# EAGLE design SparkFun_USB_MicroB_Plug_Breakout (EAGLE 6.4)
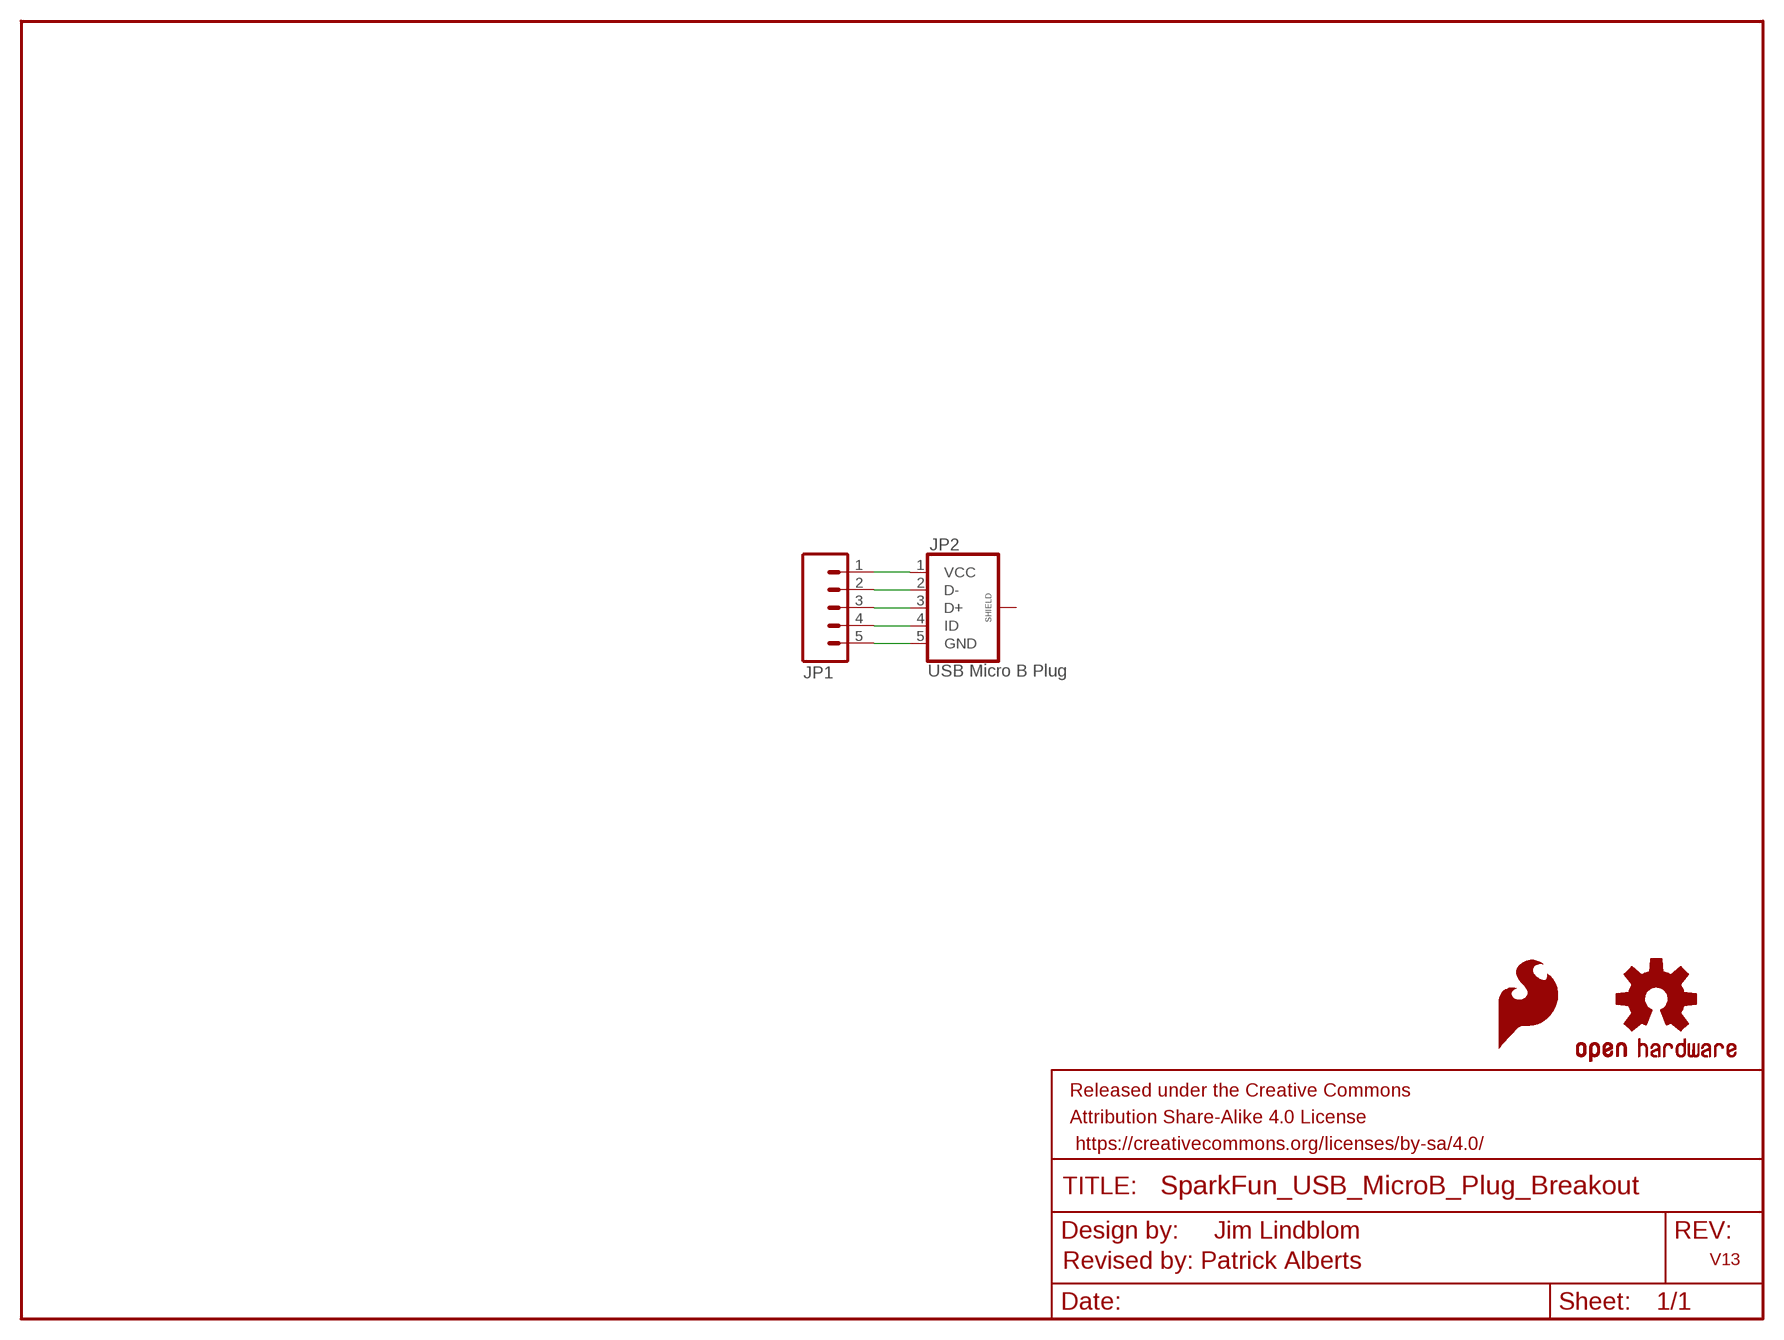
[diagram p0: schematic, sheet 1]

## Parts
FRAME1  FRAME-LETTER  [CREATIVE_COMMONS]
JP1  M05PTH  [1X05]
JP2  USB Micro B Plug  USB_MICROB_PLUG-SMT  [MICRO-B-SMT]
LOGO1  OSHW-LOGOS  [OSHW-LOGO-S]
LOGO2  SFE_LOGO_FLAME.1_INCH  [SFE_LOGO_FLAME_.1]

## Nets
N$1: JP1.1 JP2.1(VCC)
N$2: JP1.2 JP2.2(D-)
N$3: JP1.3 JP2.3(D+)
N$4: JP1.4 JP2.4(ID)
N$5: JP1.5 JP2.5(GND)
Unconnected: JP2.P$6(SHIELD)

## Notes on the sheet
- Jim Lindblom
- Revised by: Patrick Alberts | V13

## Library data of the parts
FRAME1 = SparkFun-Aesthetics:FRAME-LETTER: Schematic Frame Standard 8.5x11 US Letter frame
JP1 = SparkFun:M05: Header 5 Standard 5-pin 0.1" header. Use with straight break away headers (SKU : PRT-00116), right angle break away headers (PRT-00553), swiss pins (PRT-00743), machine pins (PRT-00117), and female headers (PRT-00115). Molex polarized connector foot print use with SKU : PRT-08230 with associated crimp pins and housings.
JP2 = SparkFun-Connectors:USB_MICROB_PLUG: USB Micro-B connectors Some male, some female. Watch your step!; PROD_ID: CONN-09900
LOGO1 = SparkFun-Aesthetics:OSHW-LOGO: Open Source Hardware Logo This logo indicates the piece of hardware it is found on incorporates a OSHW license and/or adheres to the definition of open source hardware found here: http://freedomdefined.org/OSHW
LOGO2 = SparkFun-Aesthetics:SFE_LOGO_FLAME: SFE Logo, flame only This is the SparkFun flame logo. The logo on the schematic will always be the same size; the package variant is the height of the flame. Default layer for the logo on the board is tSilk.

## Board
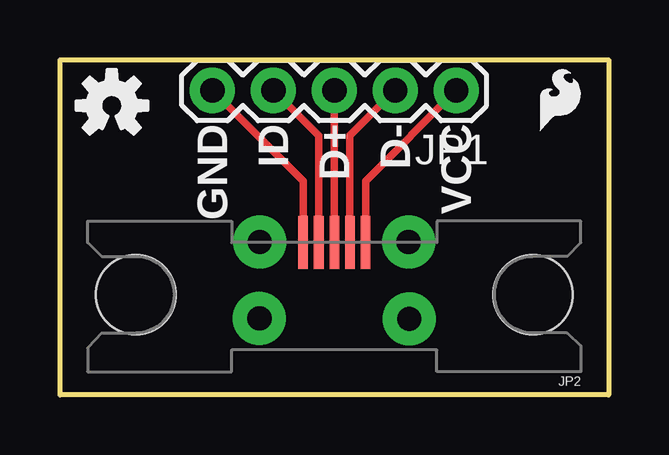
[diagram p1: board, top side]
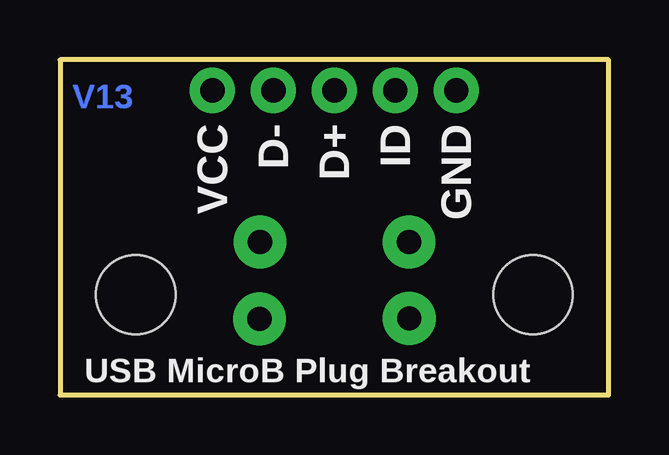
[diagram p2: board, bottom side, seen from below]

Size 22.86 x 13.97 mm. Coordinates in mm from the lower left corner, seen from the top.
Outline: 0,0 0,13.97 22.86,13.97 22.86,0 0,0
Copper layers (1*16): Top 0.035mm / dielectric 1.5mm / Bottom 0.035mm
Design rules "SparkFun": minimum track width 8mil, minimum drill 20mil, track to track 8mil, track to pad 8mil, pad to pad 8mil, via to via 8mil, smd to smd 8mil, copper to edge 9mil, drill to drill 8mil, minimum pad ring 12mil, minimum via ring 10mil, stop-mask expansion 4mil, vias tented up to drill 20mil, thermal gap 10mil

### Footprints (pad centres in the part's own frame; a part is rotated, then mirrored left to right if it is on the bottom)
1X05 = drill 1.016 pad 1.88: 1 0,0; 2 2.54,0; 3 5.08,0; 4 7.62,0; 5 10.16,0
MICRO-B-SMT = smd 0.4 x 2.2: 1 -1.3,0; 2 -0.65,0; 3 0,0; 4 0.65,0; 5 1.3,0 | drill 1.016 pad 2.2: P$6 -3.121,3.183; P$7 -3.098,-0.027; P$8 3.122,3.16; P$9 3.108,-0.026 | hole 3.3: -8.275,2.17; 8.275,2.17

### Placement (x,y rotation side)
FRAME1  -15.36,-12.19 0 top  (outside the outline)
JP1  16.51,12.7 180 top
JP2  11.43,6.35 180 top
LOGO1  2.16,12.06 0 top
LOGO2  19.68,10.67 0 top

### Tracks (layer width: path | path; a pad name or v marks a point on that pad's centre or on a via)
N$1
  Top 0.305: JP2.1 12.73,7.65 12.73,8.92 JP1.1
N$2
  Top 0.305: JP2.2 12.08,9.54 12.08,10.81 JP1.2
N$3
  Top 0.305: JP2.3 JP1.3
N$4
  Top 0.305: JP2.4 10.78,9.54 10.78,10.81 JP1.4
N$5
  Top 0.305: JP2.5 10.13,7.65 10.13,8.92 JP1.5

### Text on the board
Bottom: V13
tPlace: GND | ID | D+ | D- | VCC
bPlace: GND | ID | D+ | D- | VCC | USB MicroB Plug Breakout
tDocu: Jim Lindblom | Revised by: Patrick Alberts